# Altium schematic sheet sensor.SchDoc
size A3
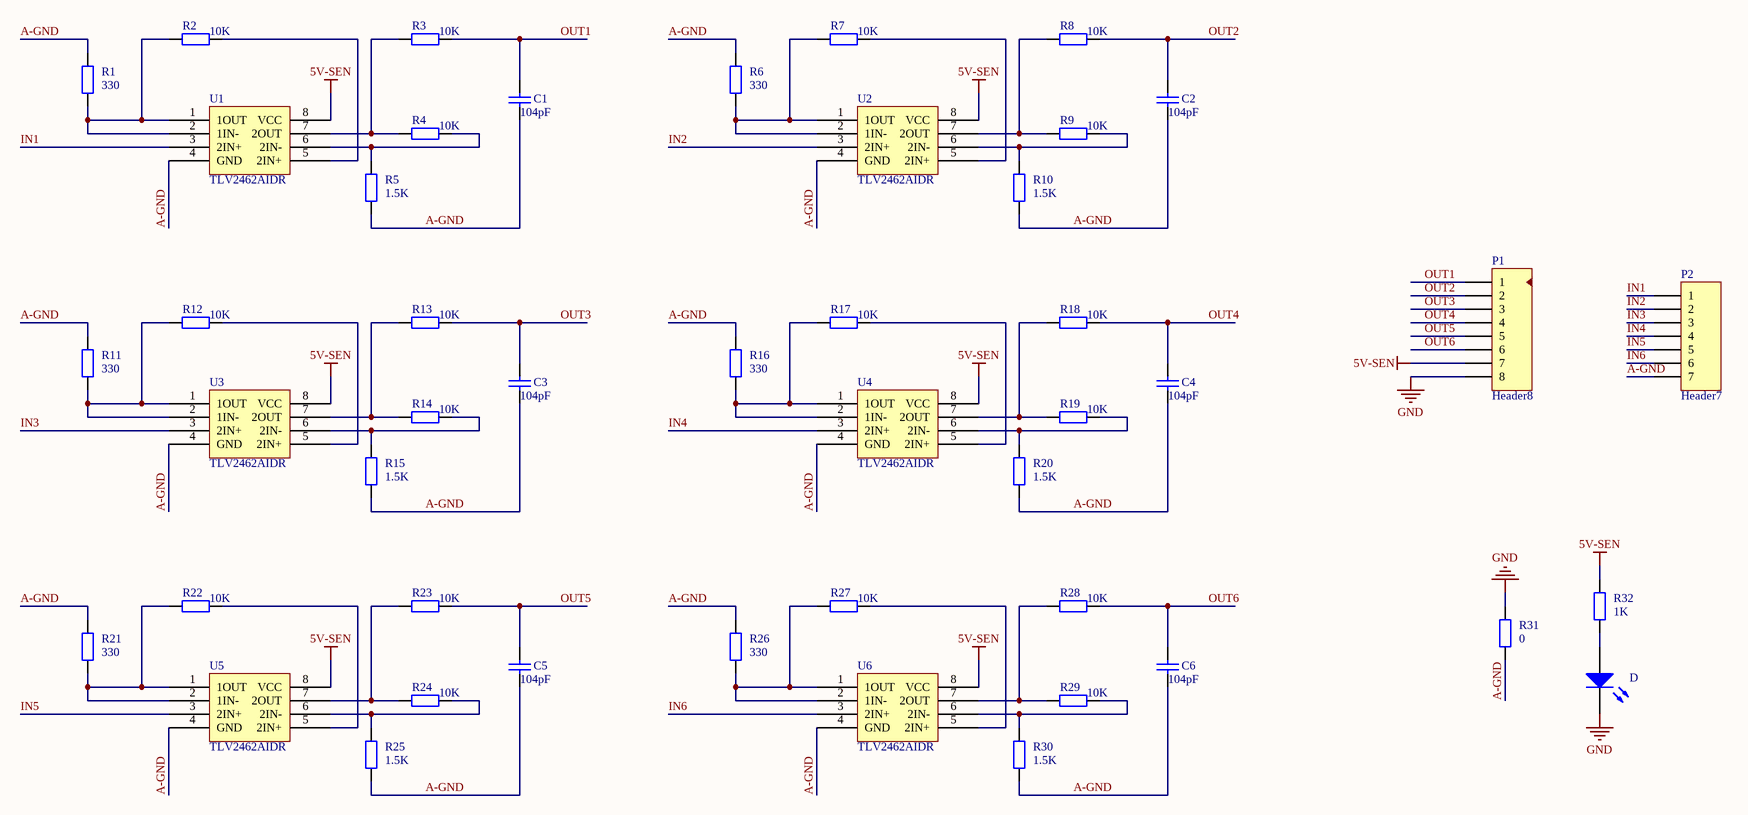
[diagram p0: sensor.SchDoc]

## Parts
C1  value 104pF  [0805]  (hidden comment: Cap)
C2  value 104pF  [0805]  (hidden comment: Cap)
C3  value 104pF  [0805]  (hidden comment: Cap)
C4  value 104pF  [0805]  (hidden comment: Cap)
C5  value 104pF  [0805]  (hidden comment: Cap)
C6  value 104pF  [0805]  (hidden comment: Cap)
D  LED3  [C-0805]  (value not drawn)
P1  Header8  [HDR1X8]
P2  Header7  [HDR1X7]
R1  value 330  [0805]  (hidden comment: Res2)
R2  value 10K  [0805]  (hidden comment: Res2)
R3  value 10K  [0805]  (hidden comment: Res2)
R4  value 10K  [0805]  (hidden comment: Res2)
R5  value 1.5K  [0805]  (hidden comment: Res2)
R6  value 330  [0805]  (hidden comment: Res2)
R7  value 10K  [0805]  (hidden comment: Res2)
R8  value 10K  [0805]  (hidden comment: Res2)
R9  value 10K  [0805]  (hidden comment: Res2)
R10  value 1.5K  [0805]  (hidden comment: Res2)
R11  value 330  [0805]  (hidden comment: Res2)
R12  value 10K  [0805]  (hidden comment: Res2)
R13  value 10K  [0805]  (hidden comment: Res2)
R14  value 10K  [0805]  (hidden comment: Res2)
R15  value 1.5K  [0805]  (hidden comment: Res2)
R16  value 330  [0805]  (hidden comment: Res2)
R17  value 10K  [0805]  (hidden comment: Res2)
R18  value 10K  [0805]  (hidden comment: Res2)
R19  value 10K  [0805]  (hidden comment: Res2)
R20  value 1.5K  [0805]  (hidden comment: Res2)
R21  value 330  [0805]  (hidden comment: Res2)
R22  value 10K  [0805]  (hidden comment: Res2)
R23  value 10K  [0805]  (hidden comment: Res2)
R24  value 10K  [0805]  (hidden comment: Res2)
R25  value 1.5K  [0805]  (hidden comment: Res2)
R26  value 330  [0805]  (hidden comment: Res2)
R27  value 10K  [0805]  (hidden comment: Res2)
R28  value 10K  [0805]  (hidden comment: Res2)
R29  value 10K  [0805]  (hidden comment: Res2)
R30  value 1.5K  [0805]  (hidden comment: Res2)
R31  value 0  [0805]  (hidden comment: Res2)
R32  value 1K  [0805]  (hidden comment: Res2)
U1  TLV2462AIDR  [TLV2462AIDR]
U2  TLV2462AIDR  [TLV2462AIDR]
U3  TLV2462AIDR  [TLV2462AIDR]
U4  TLV2462AIDR  [TLV2462AIDR]
U5  TLV2462AIDR  [TLV2462AIDR]
U6  TLV2462AIDR  [TLV2462AIDR]

## Nets
5V-SEN: P1.7 R32.2 U1.8(VCC) U2.8(VCC) U3.8(VCC) U4.8(VCC) U5.8(VCC) U6.8(VCC)
GND: D.2(K) P1.8 R31.2
A-GND: C1.1 C2.1 C3.1 C4.1 C5.1 C6.1 P2.7 R1.2 R5.1 R6.2 R10.1 R11.2 R15.1 R16.2 R20.1 R21.2 R25.1 R26.2 R30.1 R31.1 U1.4(GND) U2.4(GND) U3.4(GND) U4.4(GND) U5.4(GND) U6.4(GND)
IN1: P2.1 U1.3(2IN+)
IN2: P2.2 U2.3(2IN+)
IN3: P2.3 U3.3(2IN+)
IN4: P2.4 U4.3(2IN+)
IN5: P2.5 U5.3(2IN+)
IN6: P2.6 U6.3(2IN+)
OUT1: C1.2 P1.1 R3.2
OUT2: C2.2 P1.2 R8.2
OUT3: C3.2 P1.3 R13.2
OUT4: C4.2 P1.4 R18.2
OUT5: C5.2 P1.5 R23.2
OUT6: C6.2 P1.6 R28.2
NetD_1: D.1(A) R32.1
NetR1_1: R1.1 R2.1 U1.1(1OUT) U1.2(1IN-)
NetR2_2: R2.2 U1.5(2IN+)
NetR3_1: R3.1 R4.1 U1.7(2OUT)
NetR4_2: R4.2 R5.2 U1.6(2IN-)
NetR6_1: R6.1 R7.1 U2.1(1OUT) U2.2(1IN-)
NetR7_2: R7.2 U2.5(2IN+)
NetR8_1: R8.1 R9.1 U2.7(2OUT)
NetR9_2: R9.2 R10.2 U2.6(2IN-)
NetR11_1: R11.1 R12.1 U3.1(1OUT) U3.2(1IN-)
NetR12_2: R12.2 U3.5(2IN+)
NetR13_1: R13.1 R14.1 U3.7(2OUT)
NetR14_2: R14.2 R15.2 U3.6(2IN-)
NetR16_1: R16.1 R17.1 U4.1(1OUT) U4.2(1IN-)
NetR17_2: R17.2 U4.5(2IN+)
NetR18_1: R18.1 R19.1 U4.7(2OUT)
NetR19_2: R19.2 R20.2 U4.6(2IN-)
NetR21_1: R21.1 R22.1 U5.1(1OUT) U5.2(1IN-)
NetR22_2: R22.2 U5.5(2IN+)
NetR23_1: R23.1 R24.1 U5.7(2OUT)
NetR24_2: R24.2 R25.2 U5.6(2IN-)
NetR26_1: R26.1 R27.1 U6.1(1OUT) U6.2(1IN-)
NetR27_2: R27.2 U6.5(2IN+)
NetR28_1: R28.1 R29.1 U6.7(2OUT)
NetR29_2: R29.2 R30.2 U6.6(2IN-)

## Library data of the parts
C1-C6 = Cap: Capacitor; Published: 8-Jun-2000; LatestRevisionDate: 17-Jul-2002; LatestRevisionNote: Re-released for DXP Platform.; PackageReference: RAD-0.3; Publisher: Altium Limited; PackageDescription: Radial Cap, Thru-Hole; 2 Leads; 0.3 in Pin Spacing
D = LED3: Typical BLUE SiC LED; Published: 8-Jun-2000; LatestRevisionDate: 17-Dec-2003; LatestRevisionNote: PCB Footprint replaced.; DatasheetDocument: 16-Apr-2002; PackageDocument: 16-Apr-2002; PackageReference: 3.5X2.8X1.9; Publisher: Altium Limited
P1 = Header 8: 接插件; LatestRevisionDate: 17-Jul-2002; LatestRevisionNote: Re-released for DXP Platform.; Publisher: Altium Limited
P2 = Header 7: Header, 7-Pin; LatestRevisionDate: 17-Jul-2002; LatestRevisionNote: Re-released for DXP Platform.; Publisher: Altium Limited
R1-R32 = Res2: Resistor; Published: 8-Jun-2000; LatestRevisionDate: 17-Jul-2002; LatestRevisionNote: Re-released for DXP Platform.; PackageReference: AXIAL-0.4; Publisher: Altium Limited; PackageDescription: Axial Device, Thru-Hole; 2 Leads; 0.4 in Pin Spacing